# EAGLE design down (EAGLE 9.5.1)

## Sheet 1 of 2

## Sheet 2 of 2
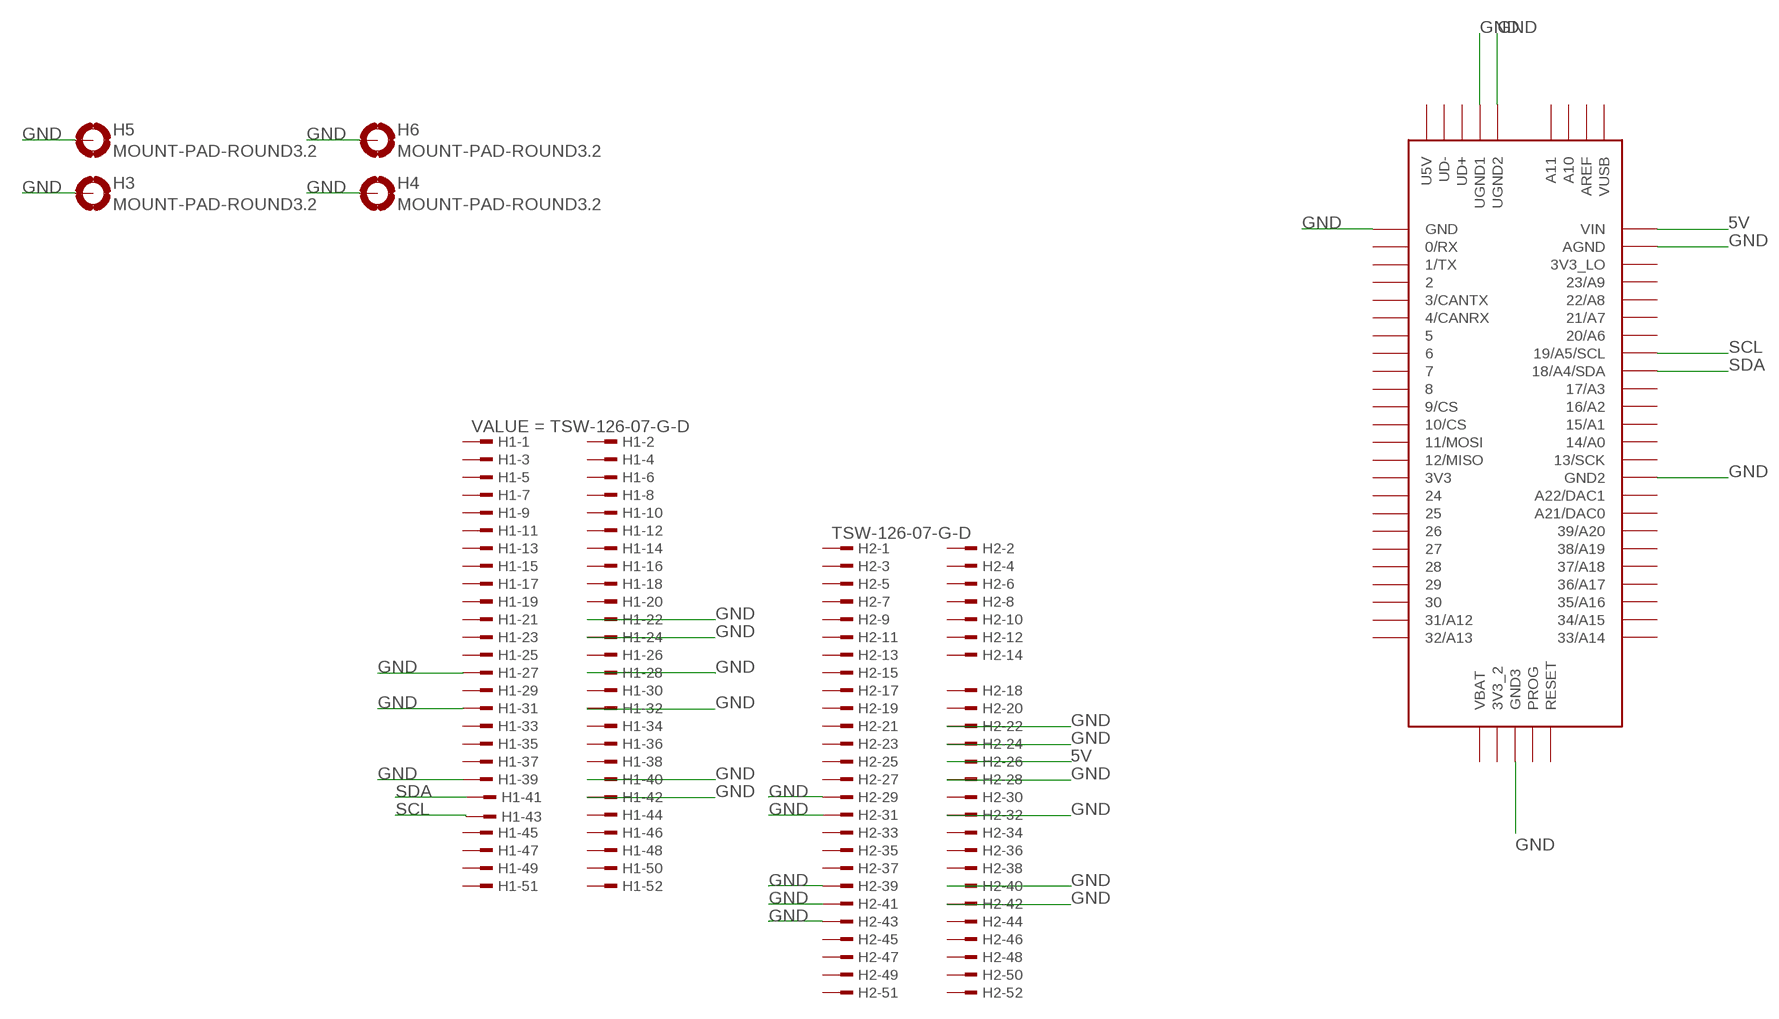
[diagram p0: schematic, sheet 2, part 1 of 2]
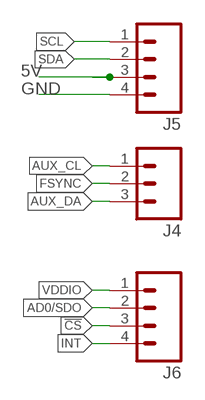
[diagram p1: schematic, sheet 2, part 2 of 2]

### Parts
H1  TSW-126-07-G-D  [TSW-126-XX-G-D]
H2  TSW-126-07-G-D  [TSW-126-XX-G-D]
H3  MOUNT-PAD-ROUND3.2  [3,2-PAD]
H4  MOUNT-PAD-ROUND3.2  [3,2-PAD]
H5  MOUNT-PAD-ROUND3.2  [3,2-PAD]
H6  MOUNT-PAD-ROUND3.2  [3,2-PAD]
J4  M03PTH  [1X03]
J5  M04PTH  [1X04]
J6  M04PTH  [1X04]
U$1  TEENSY_3.5/3.6  [TEENSY_3.5/3.6]

### Nets
5V: H2.26 J5.3 U$1.VIN
!CS: J6.3
AD0/SDO: J6.2
AUX_CL: J4.1
AUX_DA: J4.3
FSYNC: J4.2
GND: H1.22 H1.24 H1.27 H1.28 H1.31 H1.32 H1.39 H1.40 H1.42 H2.22 H2.24 H2.28 H2.29 H2.31 H2.32 H2.39 H2.40 H2.41 H2.42 H2.43 H3.B3,2(MOUNT) H4.B3,2(MOUNT) H5.B3,2(MOUNT) H6.B3,2(MOUNT) J5.4 U$1.AGND U$1.GND U$1.GND2 U$1.GND3 U$1.UGND1 U$1.UGND2
INT: J6.4
SCL: H1.43 J5.1 U$1.19/A5/SCL
SDA: H1.41 J5.2 U$1.18/A4/SDA
VDDIO: J6.1
Unconnected: H1.1 H1.2 H1.3 H1.4 H1.5 H1.6 H1.7 H1.8 H1.9 H1.10 H1.11 H1.12 H1.13 H1.14 H1.15 H1.16 H1.17 H1.18 H1.19 H1.20 H1.21 H1.23 H1.25 H1.26 H1.29 H1.30 H1.33 H1.34 H1.35 H1.36 H1.37 H1.38 H1.44 H1.45 H1.46 H1.47 H1.48 H1.49 H1.50 H1.51 H1.52 H2.1 H2.2 H2.3 H2.4 H2.5 H2.6 H2.7 H2.8 H2.9 H2.10 H2.11 H2.12 H2.13 H2.14 H2.15 H2.16 H2.17 H2.18 H2.19 H2.20 H2.21 H2.23 H2.25 H2.27 H2.30 H2.33 H2.34 H2.35 H2.36 H2.37 H2.38 H2.44 H2.45 H2.46 H2.47 H2.48 H2.49 H2.50 H2.51 H2.52 U$1.0/RX U$1.1/TX U$1.2 U$1.3/CANTX U$1.3V3 U$1.3V3_2 U$1.3V3_LO U$1.4/CANRX U$1.5 U$1.6 U$1.7 U$1.8 U$1.9/CS U$1.10/CS U$1.11/MOSI U$1.12/MISO U$1.13/SCK U$1.14/A0 U$1.15/A1 U$1.16/A2 U$1.17/A3 U$1.20/A6 U$1.21/A7 U$1.21/DAC0(A21/DAC0) U$1.22/A8 U$1.23/A9 U$1.24 U$1.25 U$1.26 U$1.27 U$1.28 U$1.29 U$1.30 U$1.31/A12 U$1.32/A13 U$1.33/A14 U$1.34/A15 U$1.35/A16 U$1.36/A17 U$1.37/A18 U$1.38/A19 U$1.39/A20 U$1.A10 U$1.A11 U$1.A22/DAC1 U$1.AREF U$1.PROG U$1.RESET U$1.U5V U$1.UD+ U$1.UD- U$1.VBAT U$1.VUSB

## Library data of the parts
H1 H2 = con-samtec:TSW-126-*-G: THROUGH-HOLE .025" SQ POST HEADER Source: Samtec TSW.pdf; MF: Samtec Inc.; MPN: TSW-126-07-G-D
H3-H6 = holes:MOUNT-PAD-ROUND: MOUNTING PAD, round
J4 = SparkFun-Connectors:M03: Header 3 Standard 3-pin 0.1" header. Use with straight break away headers (SKU : PRT-00116), right angle break away headers (PRT-00553), swiss pins (PRT-00743), machine pins (PRT-00117), and female headers (PRT-00115). Molex polarized connector foot print use with SKU : PRT-08232 with associated crimp pins and housings.
J5 J6 = SparkFun-Connectors:M04: Header 4 Standard 4-pin 0.1" header. Use with straight break away headers (SKU : PRT-00116), right angle break away headers (PRT-00553), swiss pins (PRT-00743), machine pins (PRT-00117), and female headers (PRT-00115). Molex polarized connector foot print use with SKU : PRT-08231 with associated crimp pins and housings. 1MM SMD Version SKU: PRT-10208; PROD_ID: CONN-09696
U$1 = Teensy356:TEENSY_3.5/3.6

## Board
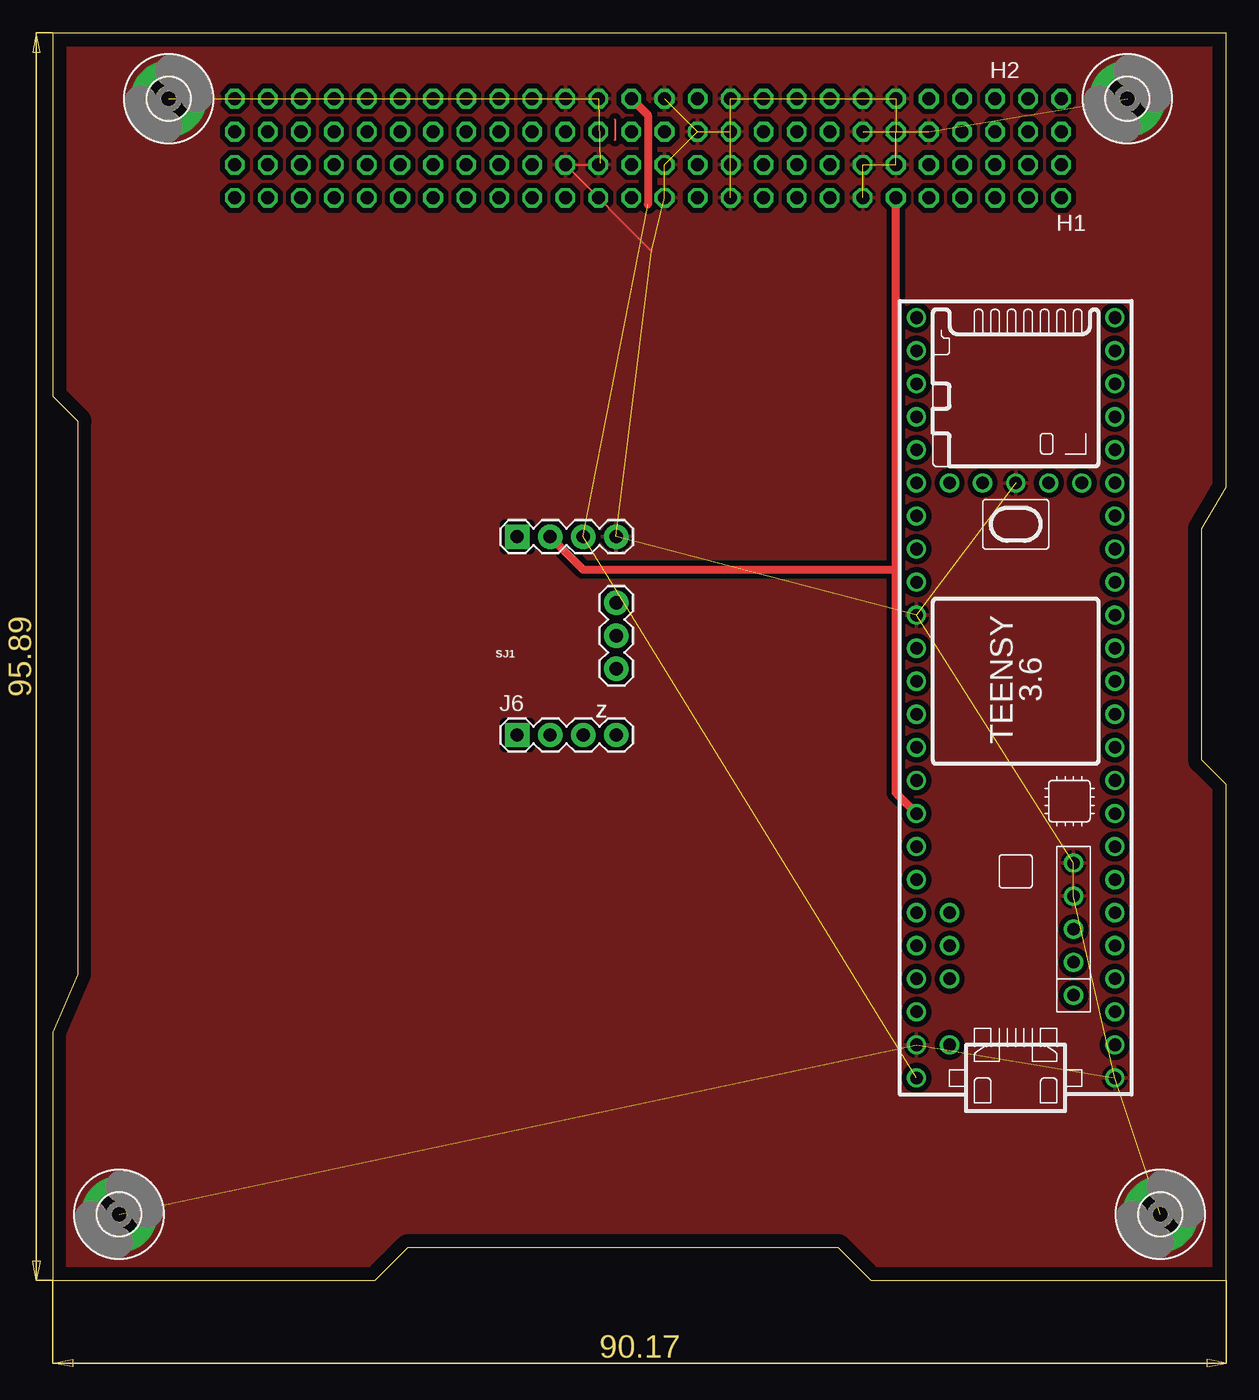
[diagram p2: board, top side]
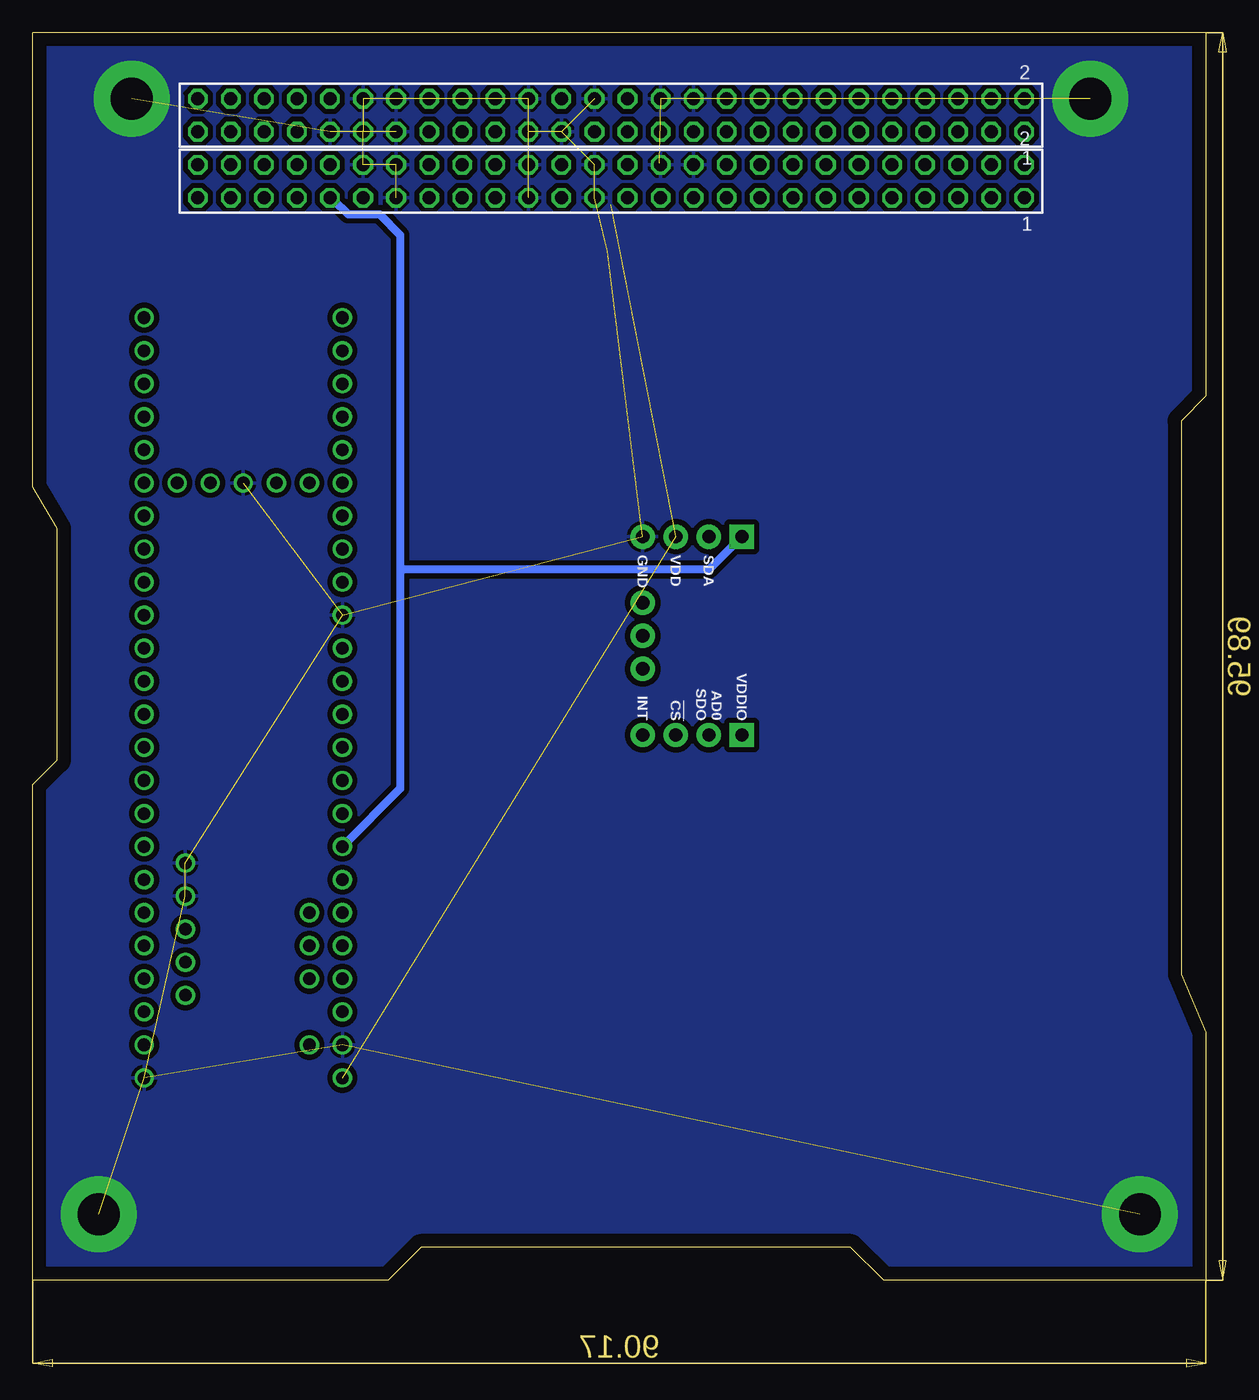
[diagram p3: board, bottom side, seen from below]

Size 90.17 x 95.89 mm. Coordinates in mm from the lower left corner, seen from the top.
Outline: 1.91,23.5 0,19.05 0,0 24.77,0 27.3,2.54 60.33,2.54 62.86,0 90.17,0 90.17,38.1 88.27,40 88.27,57.78 90.17,60.96 90.17,95.89 0,95.89 0,67.95 1.91,66.04 1.91,23.5
Copper layers (1*16): Top 0.035mm / dielectric 1.5mm / Bottom 0.035mm
Design rules "default": minimum track width 6mil, minimum drill 0.35mm, track to track 6mil, track to pad 6mil, pad to pad 6mil, via to via 6mil, smd to smd 6mil, copper to edge 40mil, drill to drill 6mil, minimum pad ring 10mil, minimum via ring 8mil, stop-mask expansion 4mil, vias tented up to drill 0mil, thermal gap 10mil

### Footprints (pad centres in the part's own frame; a part is rotated, then mirrored left to right if it is on the bottom)
TSW-126-XX-G-D = drill 1 pad 1.5 octagon: 1 31.75,-1.27; 2 31.75,1.27; 3 29.21,-1.27; 4 29.21,1.27; 5 26.67,-1.27; 6 26.67,1.27; 7 24.13,-1.27; 8 24.13,1.27; 9 21.59,-1.27; 10 21.59,1.27; 11 19.05,-1.27; 12 19.05,1.27; 13 16.51,-1.27; 14 16.51,1.27; 15 13.97,-1.27; 16 13.97,1.27; 17 11.43,-1.27; 18 11.43,1.27; 19 8.89,-1.27; 20 8.89,1.27; 21 6.35,-1.27; 22 6.35,1.27; 23 3.81,-1.27; 24 3.81,1.27; 25 1.27,-1.27; 26 1.27,1.27; 27 -1.27,-1.27; 28 -1.27,1.27; 29 -3.81,-1.27; 30 -3.81,1.27; 31 -6.35,-1.27; 32 -6.35,1.27; 33 -8.89,-1.27; 34 -8.89,1.27; 35 -11.43,-1.27; 36 -11.43,1.27; 37 -13.97,-1.27; 38 -13.97,1.27; 39 -16.51,-1.27; 40 -16.51,1.27; 41 -19.05,-1.27; 42 -19.05,1.27; 43 -21.59,-1.27; 44 -21.59,1.27; 45 -24.13,-1.27; 46 -24.13,1.27; 47 -26.67,-1.27; 48 -26.67,1.27; 49 -29.21,-1.27; 50 -29.21,1.27; 51 -31.75,-1.27; 52 -31.75,1.27
3,2-PAD = drill 3.2 pad 5.842: B3,2 0,0
1X03 = drill 1.016 pad 1.88: 1 0,0; 2 2.54,0; 3 5.08,0
1X04 = drill 1.016 pad 1.88 square: 1 0,0 | drill 1.016 pad 1.88: 2 2.54,0; 3 5.08,0; 4 7.62,0
TEENSY_3.5/3.6 = drill 0.965: 0/RX -25.4,-7.62; 1/TX -22.86,-7.62; 2 -20.32,-7.62; 3/CANTX -17.78,-7.62; 3V3 7.62,-7.62; 3V3_2 17.78,-2.54; 3V3_LO -22.86,7.62; 4/CANRX -15.24,-7.62; 5 -12.7,-7.62; 6 -10.16,-7.62; 7 -7.62,-7.62; 8 -5.08,-7.62; 9/CS -2.54,-7.62; 10/CS 0,-7.62; 11/MOSI 2.54,-7.62; 12/MISO 5.08,-7.62; 13/SCK 5.08,7.62; 14/A0 2.54,7.62; 15/A1 0,7.62; 16/A2 -2.54,7.62; 17/A3 -5.08,7.62; 18/A4/SDA -7.62,7.62; 19/A5/SCL -10.16,7.62; 20/A6 -12.7,7.62; 21/A7 -15.24,7.62; 21/DAC0 12.7,7.62; 22/A8 -17.78,7.62; 23/A9 -20.32,7.62; 24 10.16,-7.62; 25 12.7,-7.62; 26 15.24,-7.62; 27 17.78,-7.62; 28 20.32,-7.62; 29 22.86,-7.62; 30 25.4,-7.62; 31/A12 27.94,-7.62; 32/A13 30.48,-7.62; 33/A14 30.48,7.62; 34/A15 27.94,7.62; 35/A16 25.4,7.62; 36/A17 22.86,7.62; 37/A18 20.32,7.62; 38/A19 17.78,7.62; 39/A20 15.24,7.62; A10 -17.78,5.08; A11 -15.24,5.08; A22/DAC1 10.16,7.62; AGND -25.4,7.62; AREF -20.32,5.08; GND -27.94,-7.62; GND2 7.62,7.62; GND3 17.78,0; PROG 17.78,2.54; RESET 17.78,5.08; U5V -21.59,-4.445; UD+ -16.51,-4.445; UD- -19.05,-4.445; UGND1 -13.97,-4.445; UGND2 -11.43,-4.445; VBAT 17.78,-5.08; VIN -27.94,7.62; VUSB -25.4,5.08

### Placement (x,y rotation side)
H1  45.72,84.45 0 bottom
H2  45.72,89.54 0 bottom
H3  5.08,5.08 0 top
H4  8.89,90.81 0 top
H5  82.55,90.81 0 top
H6  85.09,5.08 0 top
J4  43.28,46.99 90 top
J5  35.66,57.15 0 top
J6  35.66,41.91 0 top
U$1  73.98,43.5 90 top

### Tracks (layer width: path | path; a pad name or v marks a point on that pad's centre or on a via)
5V  (2 unrouted)
  Top 0.61: 45.72,82.68 45.72,89.54 H2.26
AD0/SDO
  Top 0.254: 38.2,42.6 J6.2
AUX_CL
  Bottom 0.254: 43.23,46.99 J4.1
GND  (29 unrouted)
  Top 0.152: H1.24 H1.22 46.01,79.09
  Top 0.61: H1.24 42.03,85.85
  pour Top (isolate 0.406, rank 6): -0.63,94.62 1.27,96.52 90.17,96.52 90.17,0.64 90.81,0 0,0 -0.63,0.64
  pour Bottom (isolate 0.406, rank 6): 0,95.89 90.17,95.89 90.81,96.52 90.81,0 91.44,-0.64 0.63,-0.64 0,0
  pour Top (no thermals): 82.55,93.98 85.09,93.34 86.36,90.81 85.73,89.54 84.45,87.63 81.28,87.63 79.38,88.9 79.38,91.44 81.28,93.98
  pour Top (no thermals): 8.89,93.98 11.43,93.34 12.7,90.81 12.06,89.54 10.79,87.63 7.62,87.63 5.71,88.9 5.71,91.44 7.62,93.98
  pour Top (no thermals): 5.08,8.26 7.62,7.62 8.89,5.08 8.26,3.81 6.98,1.9 3.81,1.9 1.91,3.18 1.91,5.71 3.81,8.26
  pour Top (no thermals): 85.09,8.26 87.63,7.62 88.9,5.08 88.27,3.81 87,1.9 83.82,1.9 81.92,3.18 81.92,5.71 83.82,8.26
  pour Top (no thermals): 8.89,93.98 11.43,93.34 12.7,90.81 12.06,89.54 10.79,87.63 7.62,87.63 5.71,88.9 5.71,91.44 7.62,93.98
  pour Bottom (isolate 0.254, no thermals): 82.55,93.98 86.36,93.34 86.36,89.54 84.45,87 80.01,87 78.74,90.81 80.64,93.98
  pour Top (no thermals): 8.89,93.98 11.43,93.34 12.7,90.81 12.06,89.54 10.79,87.63 7.62,87.63 5.71,88.9 5.71,91.44 7.62,93.98
  pour Bottom (isolate 0.254, rank 6, no thermals): 11.03,87.63 6.35,87.63 5.08,91.44 6.79,94.3 10.48,93.98 12.38,91.44 12.06,90.49
  pour Bottom (no thermals): 5.08,8.89 8.89,8.26 8.89,4.45 6.98,1.9 2.54,1.9 1.27,5.71 3.18,8.89
  pour Bottom (no thermals): 85.09,8.89 88.9,8.26 88.9,4.45 87,1.9 82.55,1.9 81.28,5.71 83.19,8.89
N$1
  Top 0.152: 43.18,89.22 43.18,87.63
SCL
  Bottom 0.152: 61.85,37.85 61.91,37.78
  Bottom 0.61: H1.43 67.06,83.06 65.91,81.92 63.5,81.92 61.91,80.33 61.91,54.61 | U$1.19/A5/SCL 61.91,37.78 61.91,54.61 | J5.1 38.2,54.61 61.91,54.61
SDA
  Top 0.61: U$1.18/A4/SDA 64.77,37.46 64.77,54.61 | 64.77,54.61 H1.41 | J5.2 40.74,54.61 64.77,54.61

### Text on the board
tPlace: SJ1 | Z
bPlace: SDA | VDD | GND | VDDIO | AD0 / SDO | !CS | INT
Measures: All units in inch